# Altium schematic sheet Probe_Switches.SchDoc
size A4; SheetNumber: 6; SheetTotal: 10
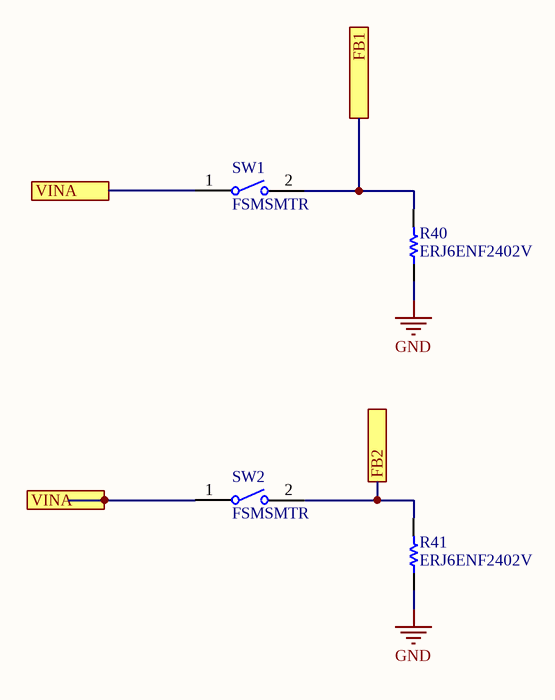
[diagram p0: Probe_Switches.SchDoc]

## Parts
R40  ERJ6ENF2402V  [RESC2013X70X40ML20T20]
R41  ERJ6ENF2402V  [RESC2013X70X40ML20T20]
SW1  FSMSMTR  [TECO-FSMSMTR_V]
SW2  FSMSMTR  [TECO-FSMSMTR_V]

## Ports
FB1 (see GlobalcircuitSchDoc[3C], Microcontroller[1C]), FB2 (see GlobalcircuitSchDoc[3C], Microcontroller[1C]), VINA (see GlobalcircuitSchDoc[3C], Communication[3B], InputSockets[2B], Microcontroller[3C], Source_and_regulation[3B])

## Nets
GND: R40.1 R41.1
FB1: R40.2 SW1.2 ; port FB1
FB2: R41.2 SW2.2 ; port FB2
VINA: SW1.1 SW2.1 ; port VINA

## Library data of the parts
R40 R41 = CMP-2001-00525-1: Manufacturer: Panasonic; Part Number: ERJ6ENF2402V
SW1 SW2 = CMP-2000-07501-1: FSMSM Push Button Switch, 50 mA, -35 to 85 degC, 2-Pin SMD, RoHS, Tape and Reel; Manufacturer: TE Connectivity; Voltage Rating (DC): 24V; Electrical Life: 20000Cycles; Operating Force: 180gf; Switch Travel: 0.25mm; Contact Current Rating: 50mA; Case\/Package: SMD/SMT; Actuator Length: 1.07mm; Throw Configuration: SPST; Actuator Material: Polyamide; Contact Resistance: 100mOhm; Illumination Type: Illuminated; Max Voltage Rating (DC): 12V; Manufacturer URL: http://www.te.com/; Lead Free: LeadFree; Packaging: TapeandReel; Min Operating Temperature: -35degC; Mechanical Life: 20000Cycles; Mount: SurfaceMount; REACH SVHC: Unknown; Package Quantity: 1800; Package Reference: FSMSMTR; RoHSCompliant: true; Max Operating Temperature: 85degC; Orientation: Straight; ELV: Compliant; Datasheet URL: http://www.te.com/commerce/DocumentDelivery/DDEController?Action=showdoc&DocId=Customer+Drawing%7F1437566-3%7FC2%7Fpdf%7FEnglish%7FENG_CD_1437566-3_C2_1437566_3_1_c.dwg.pdf%7F1437566-4; Package Description: 2-Pin Surface Mount Device, Body 6 x 3.5 mm, Pitch 9.19 mm; Current Rating: 50mA; Contact Plating: Silver; Termination: GullWing; Datasheet Version: Rev. C2, 08/2014; Contact Material: Brass; Mounting Technology: SurfaceMount